# EAGLE design tempcontrol (EAGLE 9.6.2)
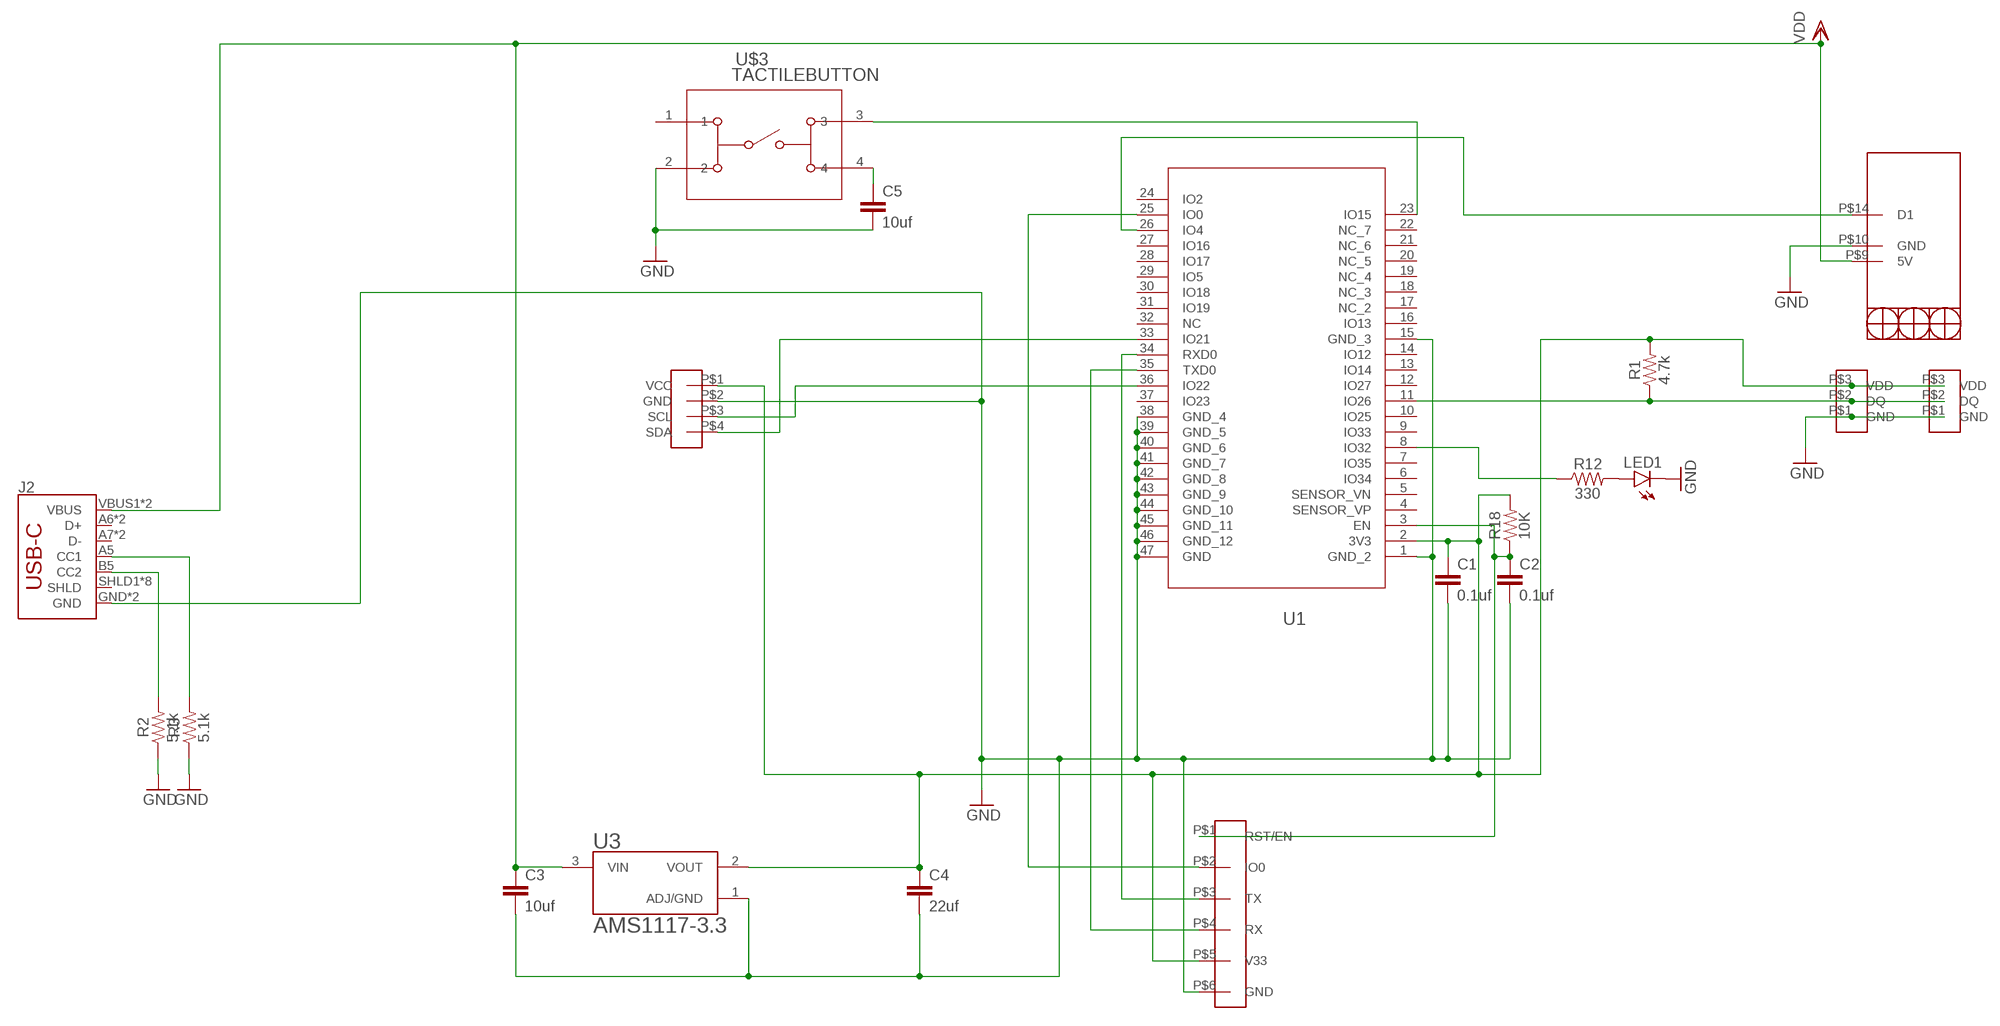
[diagram p0: schematic, sheet 1]

## Parts
C1  0.1uf  CAP-0805  [0805]
C2  0.1uf  CAP-0805  [0805]
C3  10uf  CAP-0805  [0805]
C4  22uf  CAP-0805  [0805]
C5  10uf  CAP-0805  [0805]
J2  USB_C16PIN  [USB-C-16P]
LED1  LEDSML0805  [SML0805]
R1  4.7k  RESISTOR0805  [0805]
R2  5.1k  RESISTOR0805  [0805]
R3  5.1k  RESISTOR0805  [0805]
R12  330  RESISTOR0805  [0805]
R18  10K  RESISTOR0805  [0805]
U1  ESP32-WROOM-32E_(4MB)ESP32�WROOM�32E_EXP  [ESP32�WROOM�32E_EXP]
U3  AMS1117-3.3  [SOT229P700X180-4N]
U$1  RELAYMINI  [16PINSWIDE]
U$2  DS18B20TR  [3PINS]
U$3  TACTILEBUTTON  [TACTILEPINS]
U$4  DS18B20TR  [3PINS]
U$5  USBCOUT  [6PINS]
U$18  OLEDVCC  [OLEPINS]

## Nets
3V3: C1.1 C4.1 R1.2 R18.2 U1.2(3V3) U3.2(VOUT) U$2.P$3(VDD) U$4.P$3(VDD) U$5.P$5(V33) U$18.P$1(VCC)
CC2: J2.B5(CC2) R2.2
GND: C1.2 C2.2 C3.2 C4.2 C5.2 J2.GND J2.GND2(GND) LED1.C R2.1 R3.1 U1.1(GND_2) U1.15(GND_3) U1.38(GND_4) U1.39(GND_5) U1.40(GND_6) U1.41(GND_7) U1.42(GND_8) U1.43(GND_9) U1.44(GND_10) U1.45(GND_11) U1.46(GND_12) U1.47(GND) U3.1(ADJ/GND) U$1.P$10(GND) U$2.P$1(GND) U$3.2 U$4.P$1(GND) U$5.P$6(GND) U$18.P$2(GND)
N$1: U1.26(IO4) U$1.P$14(D1)
N$2: C5.1 U$3.4
N$4: J2.A5(CC1) R3.2
N$5: U1.23(IO15) U$3.3
N$6: R1.1 U1.11(IO26) U$2.P$2(DQ) U$4.P$2(DQ)
N$13: LED1.A R12.2
N$25: C2.1 R18.1 U1.3(EN) U$5.P$1(RST/EN)
N$30: U1.25(IO0) U$5.P$2(IO0)
N$35: U1.33(IO21) U$18.P$4(SDA)
N$41: U1.35(TXD0) U$5.P$4(RX)
N$42: U1.36(IO22) U$18.P$3(SCL)
N$43: U1.34(RXD0) U$5.P$3(TX)
N$45: R12.1 U1.8(IO32)
VDD: C3.1 J2.VBUS1(VBUS) J2.VBUS2(VBUS) U3.3(VIN) U$1.P$9(5V)
Unconnected: J2.A6(D+) J2.A7(D-) J2.B6(D+) J2.B7(D-) J2.SHLD1(SHLD) J2.SHLD2(SHLD) J2.SHLD3(SHLD) J2.SHLD4(SHLD) J2.SHLD5(SHLD) J2.SHLD6(SHLD) J2.SHLD7(SHLD) J2.SHLD8(SHLD) U1.4(SENSOR_VP) U1.5(SENSOR_VN) U1.6(IO34) U1.7(IO35) U1.9(IO33) U1.10(IO25) U1.12(IO27) U1.13(IO14) U1.14(IO12) U1.16(IO13) U1.17(NC_2) U1.18(NC_3) U1.19(NC_4) U1.20(NC_5) U1.21(NC_6) U1.22(NC_7) U1.24(IO2) U1.27(IO16) U1.28(IO17) U1.29(IO5) U1.30(IO18) U1.31(IO19) U1.32(NC) U1.37(IO23) U$3.1

## Library data of the parts
C1-C5 = SparkFun-Capacitors:CAP
J2 = SparkFun-Connectors:USB_C: USB Type C 16Pin Connector Super Speed pins not available on the 16-pin purely SMD connector so this part is best for USB 2.0 implementations. D1 and D2 are tied together enabling D+/- no matter which way the cable is plugged into the connector. The two channel configuration pins (CC1/2) are exposed. These are normally connected to ground via 5.1k resistors but can be reconfigured for high current/high power applications.; PROD_ID: CONN-14122
LED1 = led:LED: LED OSRAM: - CHIPLED LG R971, LG N971, LY N971, LG Q971, LY Q971, LO R971, LY R971 LH N974, LH R974 LS Q976, LO Q976, LY Q976 LO Q996 - Hyper CHIPLED LW Q18S LB Q993, LB Q99A, LB R99A - SideLED LS A670, LO A670, LY A670, LG A670, LP A670 LB A673, LV A673, LT A673, LW A673 LH A674 LY A675 LS A676, LA A676, LO A676, LY A676, LW A676 LS A679, LY A679, LG A679 - Hyper Micro SIDELED® LS Y876, LA Y876, LO Y876, LY Y876 LT Y87S - SmartLED LW L88C, LW L88S LB L89C, LB L89S, LG L890 LS L89K, LO L89K, LY L89K LS L896, LA L896, LO L896, LY L896 - TOPLED LS T670, LO T670, LY T670, LG T670, LP T670 LSG T670, LSP T670, LSY T670, LOP T670, LYG T670 LG T671, LOG T671, LSG T671 LB T673, LV T673, LT T673, LW T673 LH T674 LS T676, LA T676, LO T676, LY T676, LB T676, LH T676, LSB T676, LW T676 LB T67C, LV T67C, LT T67C, LS T67K, LO T67K, LY T67K, LW E67C LS E67B, LA E67B, LO E67B, LY E67B, LB E67C, LV E67C, LT E67C LW T67C LS T679, LY T679, LG T679 LS T770, LO T770, LY T770, LG T770, LP T770 LB T773, LV T773, LT T773, LW T773 LH T774 LS E675, LA E675, LY E675, LS T675 LS T776, LA T776, LO T776, LY T776, LB T776 LHGB T686 LT T68C, LB T68C - Hyper Mini TOPLED® LB M676 - Mini TOPLED Santana® LG M470 LS M47K, LO M47K, LY M47K Source: http://www.osram.convergy.de LUXEON: - LUMILED® LXK2-PW12-R00, LXK2-PW12-S00, LXK2-PW14-U00, LXK2-PW14-V00 LXK2-PM12-R00, LXK2-PM12-S00, LXK2-PM14-U00 LXK2-PE12-Q00, LXK2-PE12-R00, LXK2-PE12-S00, LXK2-PE14-T00, LXK2-PE14-U00 LXK2-PB12-K00, LXK2-PB12-L00, LXK2-PB12-M00, LXK2-PB14-N00, LXK2-PB14-P00, LXK2-PB14-Q00 LXK2-PR12-L00, LXK2-PR12-M00, LXK2-PR14-Q00, LXK2-PR14-R00 LXK2-PD12-Q00, LXK2-PD12-R00, LXK2-PD12-S00 LXK2-PH12-R00, LXK2-PH12-S00 LXK2-PL12-P00, LXK2-PL12-Q00, LXK2-PL12-R00 Source: www.luxeon.com KINGBRIGHT: KA-3528ASYC Source: www.kingbright.com
R1-R3 R12 R18 = SparkFun-Resistors:RESISTOR: Generic Resistor Package
U1 = 2024-11-24_23-16-38_Library:ESP32-WROOM-32E_(4MB); COPYRIGHT: Copyright (C) 2024 Ultra Librarian. All rights reserved.; MANUFACTURER_PART_NUMBER: ESP32-WROOM-32E (4MB); MFR_NAME: Espressif Systems
U3 = AMS1117-3.3:AMS1117-3.3: Sot223/Pkg 1-Amp 3.3-Volt Low Drop Out Voltage Regulatator; AVAILABILITY: Unavailable; DESCRIPTION: Sot223/Pkg 1-Amp 3.3-Volt Low Drop Out Voltage Regulatator; MF: Advanced Monolithic Systems; MP: AMS1117-3.3; PACKAGE: None; PRICE: None
U$1 = Termostat:RELAYMINI
U$2 U$4 = Termostat:DS18B20TR
U$3 = MouseLib:TACTILEBUTTON
U$5 = MouseLib:USBCOUT
U$18 = MouseLib:OLEDVCC

## Net classes
1 power: width 0.178 mm

## Board
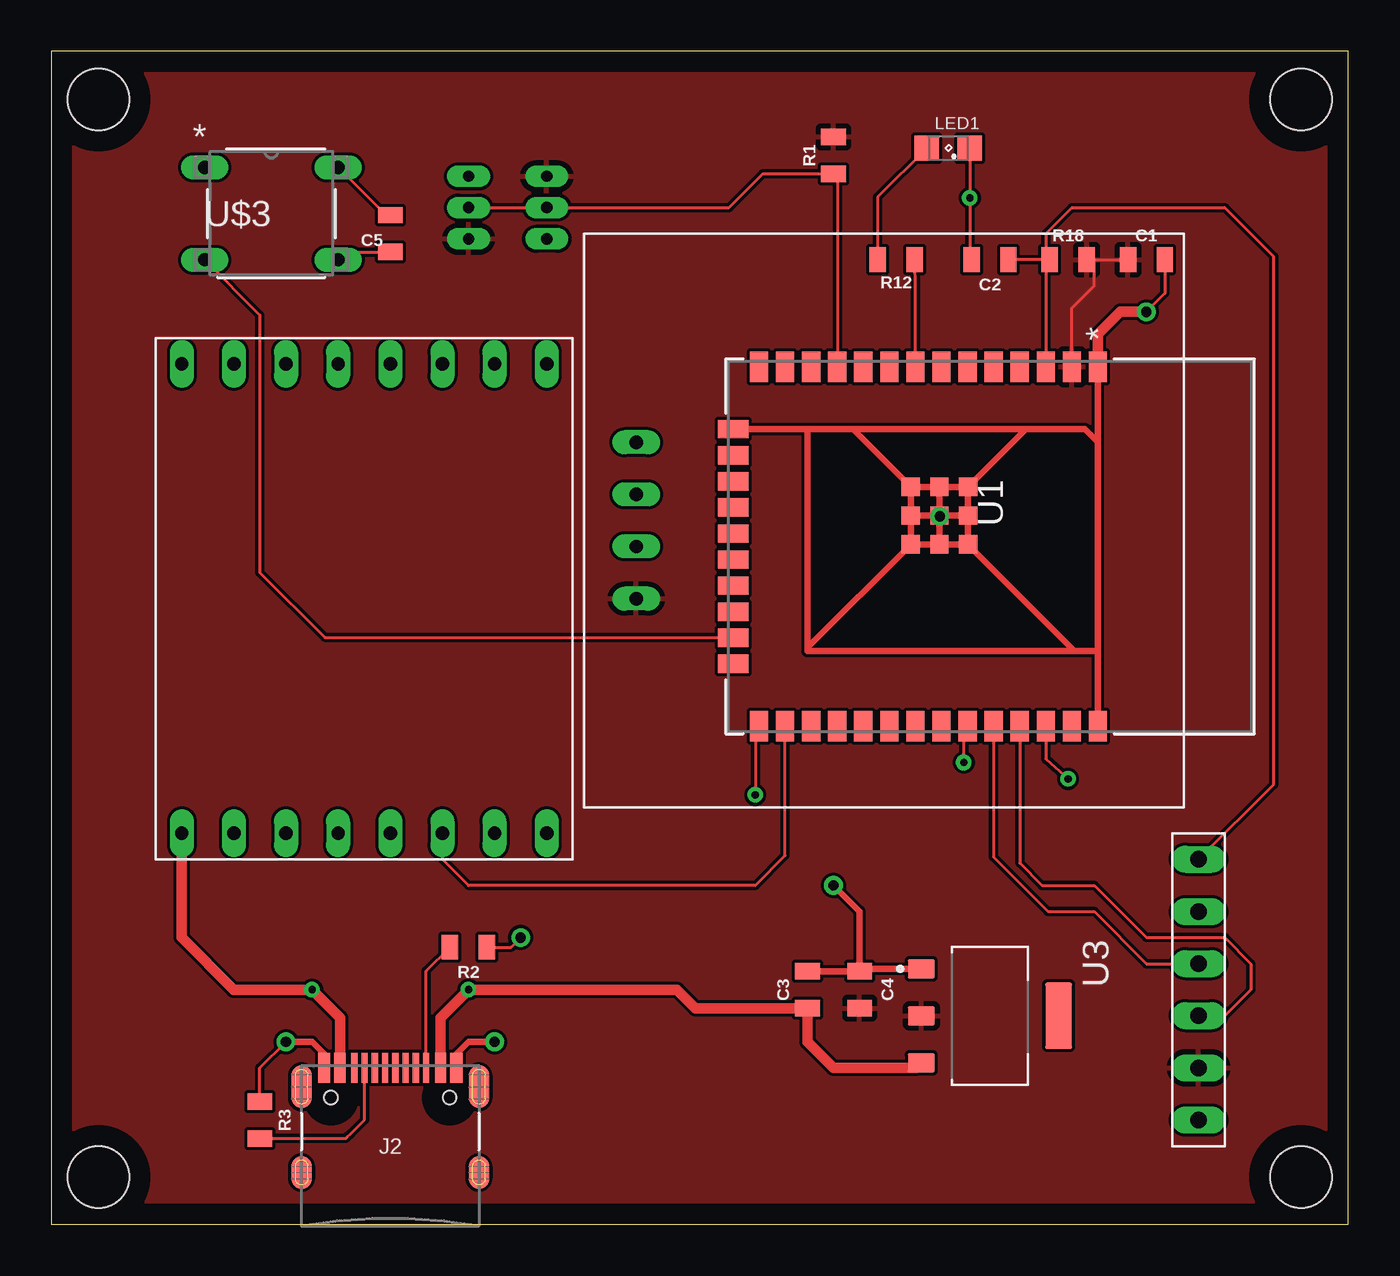
[diagram p1: board, top side]
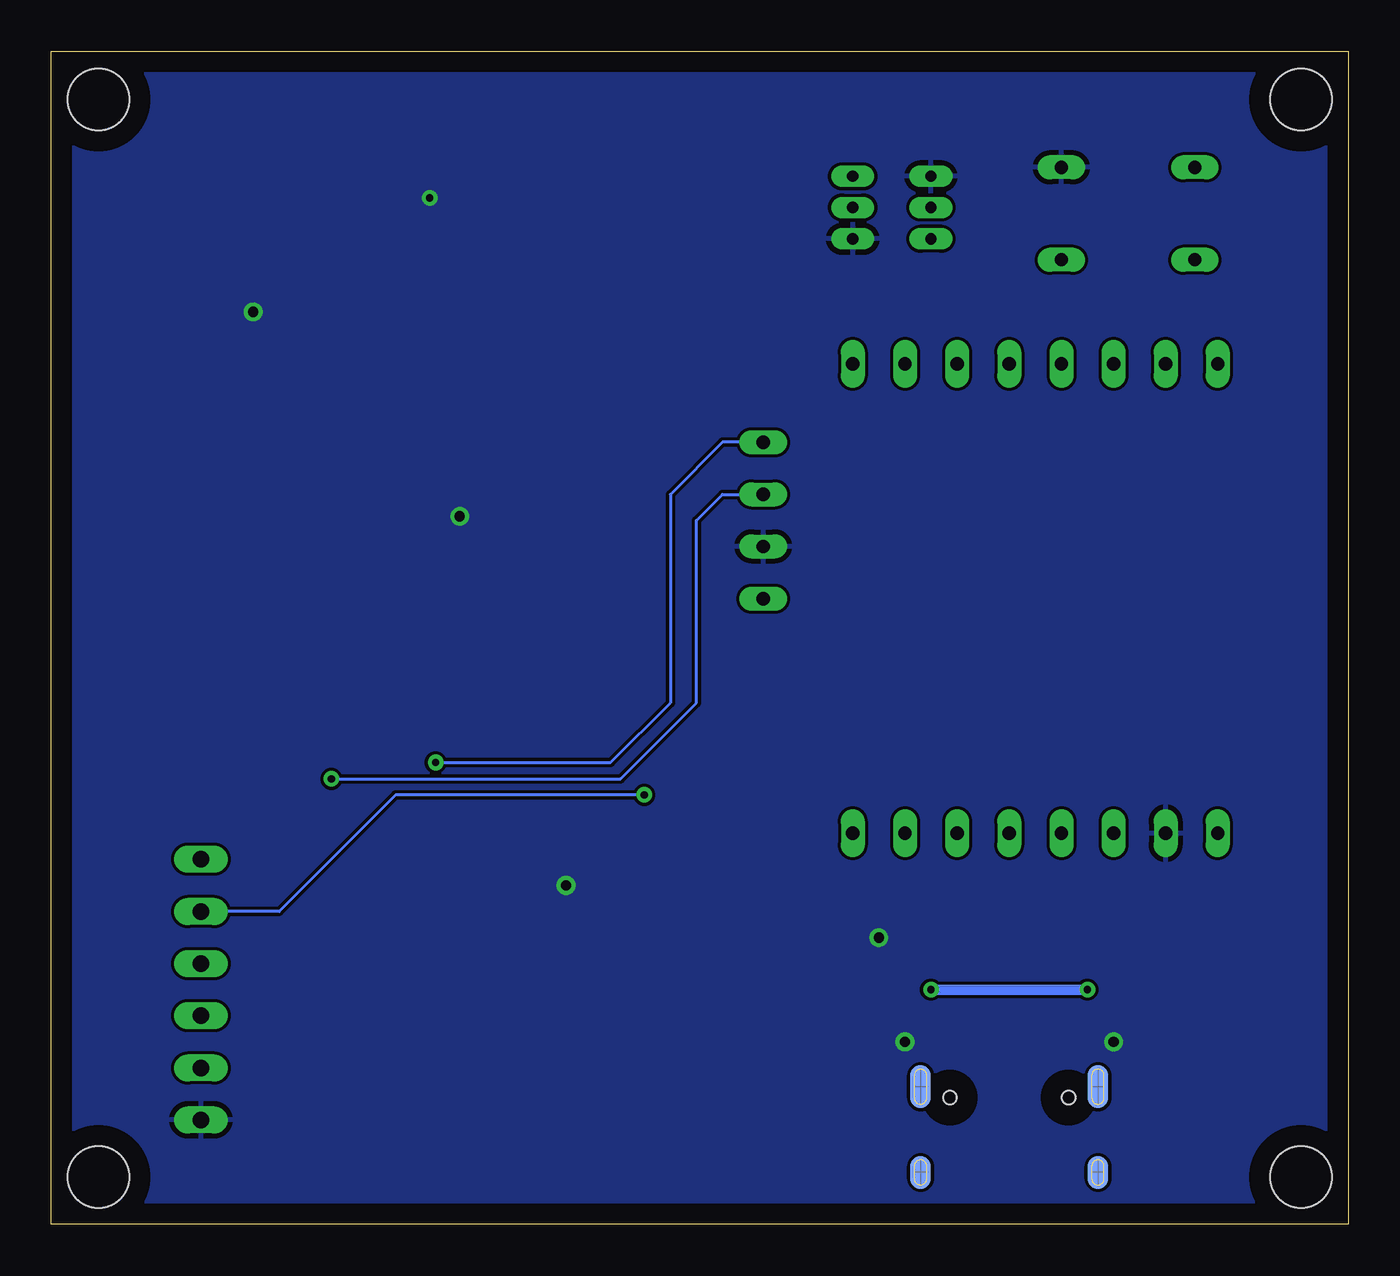
[diagram p2: board, bottom side, seen from below]

Size 63.17 x 57.14 mm. Coordinates in mm from the lower left corner, seen from the top.
Outline: 0,0 63.17,0 63.17,57.14 0,57.14 0,0
Copper layers (1*16): Top 0.035mm / dielectric 1.5mm / Bottom 0.035mm
Design rules "default": minimum track width 6mil, minimum drill 0.35mm, track to track 6mil, track to pad 6mil, pad to pad 6mil, via to via 6mil, smd to smd 6mil, copper to edge 40mil, drill to drill 6mil, minimum pad ring 10mil, minimum via ring 8mil, stop-mask expansion 4mil, vias tented up to drill 0mil, thermal gap 10mil
Holes 3 mm at 2.3,2.3 60.87,54.8 60.87,2.3 2.3,54.8

### Footprints (pad centres in the part's own frame; a part is rotated, then mirrored left to right if it is on the bottom)
0805 = smd 0.8 x 1.2: 1 -0.9,0; 2 0.9,0
USB-C-16P = smd 0.3 x 1.45: A5 -1.25,0; A6 -0.25,0; A7 0.25,0; A8 1.25,0; B5 1.75,0; B6 0.75,0; B7 -0.75,0; B8 -1.75,0 | smd 0.6 x 1.45: GND -3.225,0; GND2 3.225,0 | smd 1 x 2.1: SHLD1 -4.32,-0.915; SHLD2 4.32,-0.915 | smd 1 x 2.1 bottom: SHLD3 -4.32,-0.915; SHLD4 4.32,-0.915 | smd 1 x 1.6: SHLD5 -4.32,-5.095; SHLD8 4.32,-5.095 | smd 1 x 1.6 bottom: SHLD6 -4.32,-5.095; SHLD7 4.32,-5.095 | smd 0.55 x 1.45: VBUS1 -2.45,0; VBUS2 2.45,0 | hole 0.65: -2.89,-1.445; 2.89,-1.445
SML0805 = smd 1.2 x 1.2: A 1.05,0; C -1.05,0
ESP32�WROOM�32E_EXP = smd 1.499 x 0.889: 1 -8.75,5.26; 2 -8.75,3.99; 3 -8.75,2.72; 4 -8.75,1.45; 5 -8.75,0.18; 6 -8.75,-1.09; 7 -8.75,-2.36; 8 -8.75,-3.63; 9 -8.75,-4.9; 10 -8.75,-6.17; 11 -8.75,-7.44; 12 -8.75,-8.71; 13 -8.75,-9.98; 14 -8.75,-11.25; 25 8.75,-11.25; 26 8.75,-9.98; 27 8.75,-8.71; 28 8.75,-7.44; 29 8.75,-6.17; 30 8.75,-4.9; 31 8.75,-3.63; 32 8.75,-2.36; 33 8.75,-1.09; 34 8.75,0.18; 35 8.75,1.45; 36 8.75,2.72; 37 8.75,3.99; 38 8.75,5.26 | smd 0.889 x 1.499: 15 -5.715,-12.501; 16 -4.445,-12.501; 17 -3.175,-12.501; 18 -1.905,-12.501; 19 -0.635,-12.501; 20 0.635,-12.501; 21 1.905,-12.501; 22 3.175,-12.501; 23 4.445,-12.501; 24 5.715,-12.501 | smd 0.889 x 0.889: 39 -1.501,-2.461; 40 -2.901,-1.062; 41 -2.901,-2.461; 42 -2.901,-3.861; 43 -1.501,-3.861; 44 -0.102,-3.861; 45 -0.102,-2.461; 46 -0.102,-1.062; 47 -1.501,-1.062
SOT229P700X180-4N = smd 0.93 x 1.31: 1 -2.29,-3.345; 2 0,-3.345; 3 2.29,-3.345 | smd 3.24 x 1.31: 4 0,3.345
16PINSWIDE = drill 0.65 long: P$1 -11.43,8.89; P$2 -11.43,6.35; P$3 -11.43,3.81; P$4 -11.43,1.27; P$5 -11.43,-1.27; P$6 -11.43,-3.81; P$7 -11.43,-6.35; P$8 -11.43,-8.89; P$9 11.43,-8.89; P$10 11.43,-6.35; P$11 11.43,-3.81; P$12 11.43,-1.27; P$13 11.43,1.27; P$14 11.43,3.81; P$15 11.43,6.35; P$16 11.43,8.89
3PINS = drill 0.55 pad 0.813 long: P$1 0,1.524; P$2 0,0; P$3 0,-1.524
TACTILEPINS = drill 0.65 long: 1 -3.962,3.226; 2 2.54,3.226; 3 -3.962,-1.27; 4 2.54,-1.27
6PINS = drill 0.8 pad 1.143 long: P$1 -2.54,10.16; P$2 -2.54,7.62; P$3 -2.54,5.08; P$4 -2.54,2.54; P$5 -2.54,0; P$6 -2.54,-2.54
OLEPINS = drill 0.65 long: P$1 -3.81,12.7; P$2 -1.27,12.7; P$3 1.27,12.7; P$4 3.81,12.7

### Placement (x,y rotation side)
C1  53.34,46.99 0 top
C2  45.72,46.99 180 top
C3  36.83,11.43 90 top
C4  39.37,11.43 90 top
C5  16.51,48.26 90 top
J2  16.51,7.62 0 top
LED1  43.69,52.42 180 top
R1  38.1,52.07 90 top
R2  20.32,13.5 180 top
R3  10.16,5.08 270 top
R12  41.15,46.99 180 top
R18  49.53,46.99 0 top
U1  45.72,33.02 270 top
U3  45.72,10.16 270 top
U$1  15.24,30.48 270 top
U$2  24.13,49.53 180 top
U$3  11.43,48.26 0 top
U$4  20.32,49.53 0 top
U$5  58.42,7.62 0 top
U$18  41.19,34.29 90 top

### Tracks (layer width: path | path; a pad name or v marks a point on that pad's centre or on a via)
3V3
  Top 0.152: R18.2 50.8,46.99 | 50.8,46.99 C1.1 | U1.2 49.71,44.63 50.8,45.72 50.8,46.99
  pour Top: 0,63.5 -5.08,58.42 -5.08,-1.27 1.27,-7.62 69.85,-7.62 69.85,63.5
CC2
  Top 0.152: R2.2 18.26,12.34 J2.B5
GND  (via drill 0.35, 0.5)
  Top 0.152: U$3.2 16.3,49.16 C5.2 | LED1.C v44.74,50 44.74,47.07 C2.2 | C1.2 54.24,45.35 v53.34,44.45 | U1.42 41.91,35.92 | 41.91,34.52 U1.43 | v11.43,8.89 10.16,7.62 R3.1 | R2.1 22.39,13.5 v22.86,13.97
  Top 0.305: U1.38 50.98,27.94 | U1.42 39.05,38.73 | U1.15 36.83,38.73 | 36.83,38.73 39.05,38.73 | 36.83,38.73 36.83,28.09 | 49.84,27.94 36.83,27.94 36.83,28.09 | 50.98,27.94 50.98,38.1 | 50.98,38.1 U1.1 | 50.98,38.1 50.34,38.73 47.47,38.73 | 47.47,38.73 39.05,38.73 | U1.46 49.84,27.94 | 49.84,27.94 50.98,27.94 | U1.44 36.83,28.09 | U1.40 47.47,38.73 | U1.42 U1.41 | U1.41 U1.40 | U1.40 U1.47 | U1.46 U1.45 | U1.45 U1.44 | U1.44 41.86,34.47 41.91,34.52 | U1.42 U1.43 U1.39 | U1.39 U1.41 | U1.39 U1.45 | C4.2 39.37,15.24 v38.1,16.51 | U1.39 U1.47 | U1.47 U1.46 | J2.GND 13.29,8.3 12.7,8.89 v11.43,8.89 | J2.GND2 19.73,8.3 20.32,8.89 v21.59,8.89 | C3.2 C4.2 | C4.2 39.49,12.45 U3.1
  Top 0.508: U1.1 50.98,43.36 52.07,44.45 v53.34,44.45 | 36.95,12.45 C3.2
  other vias: 43.28,34.49
  pour Bottom: -2.54,-1.27 0,-3.81 62.23,-3.81 66.04,0 66.04,58.42 63.5,60.96 0,60.96 -2.54,58.42
N$1
  Top 0.152: U1.26 35.74,17.96 34.29,16.51 20.32,16.51 19.05,17.78 U$1.P$14
N$2
  Top 0.152: U$3.4 14.34,47.36 C5.1
N$4
  Top 0.152: J2.A5 15.26,5.1 14.61,4.45 14.39,4.23 14.34,4.18 R3.2
N$5
  Top 0.152: U$3.3 10.16,44.3 10.16,31.75 13.34,28.57 U1.23
N$6
  Top 0.152: U1.11 38.28,50.99 R1.1 34.66,51.17 33.02,49.53 U$2.P$2 U$4.P$2
N$13
  Top 0.152: LED1.A 40.25,50.03 R12.2
N$25
  Top 0.152: 48.45,46.8 R18.1 C2.1 | 48.45,46.8 48.44,46.8 U1.3 | 48.45,46.8 48.45,48.26 49.72,49.53 57.15,49.53 59.54,47.14 59.54,22.86 59.54,21.44 U$5.P$1
N$30  (via drill 0.35)
  Top 0.152: v34.29,20.92 34.29,24.09 U1.25
  Bottom 0.152: v34.29,20.92 46.39,20.92 52.07,15.24 U$5.P$2
N$35  (via drill 0.35)
  Top 0.152: v44.45,22.5 44.45,24.09 U1.33
  Bottom 0.152: U$18.P$4 30.48,38.1 33.02,35.56 33.02,25.4 35.92,22.5 v44.45,22.5
N$41
  Top 0.152: U1.35 47.17,17.6 48.26,16.51 50.8,16.51 53.34,13.97 57.15,13.97 58.42,12.7 58.42,11.43 57.15,10.16 U$5.P$4
N$42  (via drill 0.35)
  Top 0.152: U1.36 48.44,22.68 v49.53,21.7
  Bottom 0.152: U$18.P$3 30.48,35.56 31.75,34.29 31.75,25.4 35.45,21.7 v49.53,21.7
N$43
  Top 0.152: U1.34 45.9,17.89 48.55,15.24 50.8,15.24 53.34,12.7 U$5.P$3
N$45
  Top 0.152: R12.1 42.09,46.03 U1.8
VDD  (via drill 0.35)
  Top 0.508: U3.3 42.12,7.62 38.1,7.62 36.83,8.89 C3.1 31.38,10.53 30.48,11.43 v20.32,11.43 18.96,10.07 J2.VBUS2 | J2.VBUS1 14.06,10.07 v12.7,11.43 8.89,11.43 6.35,13.97 U$1.P$9
  Bottom 0.508: v12.7,11.43 v20.32,11.43